# Altium project UU111_UUControl_CPUBoard.PrjPcb
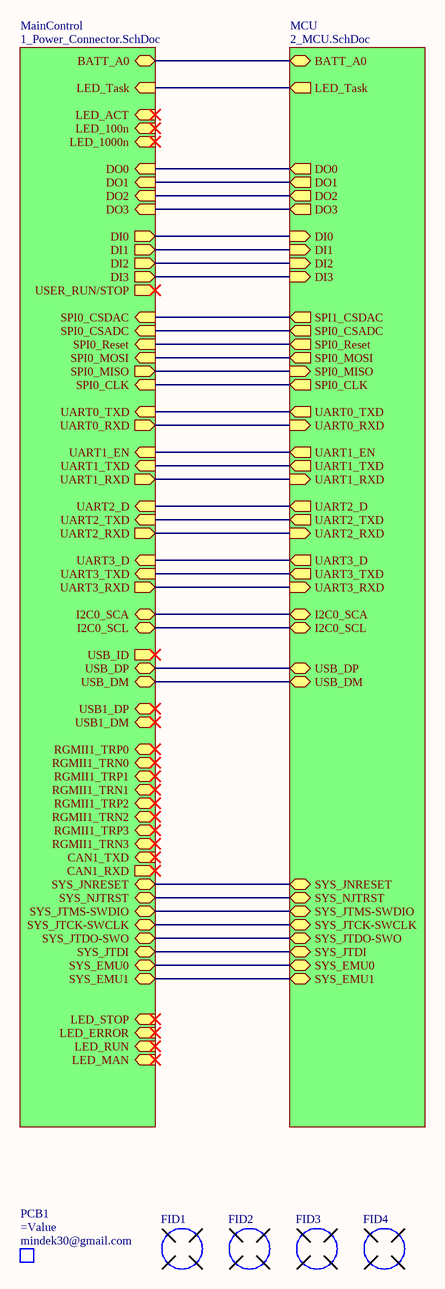
[diagram p0: 0_Overview.SchDoc]
PCB_Name: UU Control Board CPU; PCB_PN: UU111; PCB_Rev: A; PCBA_PN: UU111; PCBA_Rev: A
3 sheets, 66 parts. Net scope: hierarchical (ports join the sheet entries above them; power ports are global).
Board file: UU111_UUControl_CPUBoard.PcbDoc
Sheets:
  0_Overview.SchDoc
    MainControl = 1_Power_Connector.SchDoc
    MCU = 2_MCU.SchDoc

## Sheet 0_Overview.SchDoc: Overview
size A3; DocumentNumber: 1; SheetNumber: 1; SheetTotal: 6; PageSetup: Record=PageOptions|CenterHorizontal=True|CenterVertical=True|PrintScale=1.01|XCorrection=1.00|YCorrection=1.00|PrintKind=0|BorderSize=5000000|LeftOffset=0|BottomOffset=0|Orientation=2|PaperLength=1000|PaperWidth=1000|Scale=100|PaperSource=7|PrintQuality=-4|MediaType=1|DitherType=10|PaperKind=A3|PrintScaleMode=1

### Parts
FID1  FIDUCIAL  [FID]  (value not drawn)  (no BOM)
FID2  FIDUCIAL  [FID]  (value not drawn)  (no BOM)
FID3  FIDUCIAL  [FID]  (value not drawn)  (no BOM)
FID4  FIDUCIAL  [FID]  (value not drawn)  (no BOM)
PCB1  Manufacturer: mindek30@gmail.com  (mechanical)

### Sub-sheets
MainControl = 1_Power_Connector.SchDoc: BATT_A0 (bidir), LED_Task (in), RGMII1_TRP1 (bidir), RGMII1_TRN3 (bidir), RGMII1_TRN0 (bidir), RGMII1_TRP3 (bidir), RGMII1_TRN2 (bidir), RGMII1_TRN1 (bidir), RGMII1_TRP2 (bidir), RGMII1_TRP0 (bidir), USB_DP (bidir), USB_DM (bidir), USB1_DP (bidir), USB1_DM (bidir), USB_ID (out), I2C0_SCA (bidir), I2C0_SCL (bidir), UART3_TXD (in), UART3_D (in), UART3_RXD (out), UART1_RXD (out), UART2_TXD (in), UART1_TXD (in), UART1_EN (in), UART2_RXD (out), UART2_D (in), UART0_TXD (in), UART0_RXD (out), SPI0_MISO (out), SPI0_CLK (in), SPI0_MOSI (in), SPI0_CSADC (in), SPI0_Reset (in), LED_ACT (in), LED_100n (in), LED_1000n (in), DO1 (in), DO0 (in), DO3 (in), DO2 (in), DI3 (out), DI1 (out), DI2 (out), DI0 (out), SYS_JTCK-SWCLK (bidir), SYS_JTDI (bidir), SYS_JTDO-SWO (bidir), SYS_EMU1 (bidir), SYS_EMU0 (bidir), SYS_JNRESET (bidir), SYS_NJTRST (bidir), SYS_JTMS-SWDIO (bidir), CAN1_TXD (in), CAN1_RXD (out), SPI0_CSDAC (in), USER_RUN/STOP (out), LED_STOP (in), LED_ERROR (in), LED_RUN (in), LED_MAN (in)
MCU = 2_MCU.SchDoc: BATT_A0 (bidir), LED_Task (out), DO0 (out), DO1 (out), DO2 (out), DO3 (out), DI0 (in), DI1 (in), DI2 (in), DI3 (in), SPI0_CSADC (out), SPI0_Reset (out), SPI0_MOSI (out), SPI0_MISO (in), SPI0_CLK (out), UART0_TXD (out), UART0_RXD (in), UART1_EN (out), UART1_TXD (out), UART1_RXD (in), UART2_D (out), UART2_TXD (out), UART2_RXD (in), UART3_D (out), UART3_TXD (out), UART3_RXD (in), I2C0_SCA (bidir), I2C0_SCL (bidir), SYS_JNRESET (bidir), SYS_NJTRST (bidir), SYS_JTMS-SWDIO (bidir), SYS_JTCK-SWCLK (bidir), SYS_JTDO-SWO (bidir), SYS_JTDI (bidir), SYS_EMU0 (bidir), SYS_EMU1 (bidir), USB_DP (bidir), USB_DM (bidir), SPI1_CSDAC (out)

### Nets
I2C0_SCA: sheet MainControl/I2C0_SCA, sheet MCU/I2C0_SCA
I2C0_SCL: sheet MainControl/I2C0_SCL, sheet MCU/I2C0_SCL
LED_Task: sheet MainControl/LED_Task, sheet MCU/LED_Task
MCU_RESET: sheet MainControl/SYS_JNRESET, sheet MCU/SYS_JNRESET
SPI0_CSDAC: sheet MainControl/SPI0_CSDAC, sheet MCU/SPI1_CSDAC
SPI0_MISO: sheet MainControl/SPI0_MISO, sheet MCU/SPI0_MISO
SPI0_MOSI: sheet MainControl/SPI0_MOSI, sheet MCU/SPI0_MOSI
SPI0_SCK: sheet MainControl/SPI0_CLK, sheet MCU/SPI0_CLK
SYS_EMU0: sheet MainControl/SYS_EMU0, sheet MCU/SYS_EMU0
SYS_EMU1: sheet MainControl/SYS_EMU1, sheet MCU/SYS_EMU1
SYS_JTCK-SWCLK: sheet MainControl/SYS_JTCK-SWCLK, sheet MCU/SYS_JTCK-SWCLK
SYS_JTDI: sheet MainControl/SYS_JTDI, sheet MCU/SYS_JTDI
SYS_JTDO-SWO: sheet MainControl/SYS_JTDO-SWO, sheet MCU/SYS_JTDO-SWO
SYS_JTMS-SWDIO: sheet MainControl/SYS_JTMS-SWDIO, sheet MCU/SYS_JTMS-SWDIO
SYS_NJTRST: sheet MainControl/SYS_NJTRST, sheet MCU/SYS_NJTRST
UART0_RX: sheet MainControl/UART0_RXD, sheet MCU/UART0_RXD
UART0_TX: sheet MainControl/UART0_TXD, sheet MCU/UART0_TXD
UART1_LTE_EN: sheet MainControl/UART1_EN, sheet MCU/UART1_EN
UART1_LTE_RX: sheet MainControl/UART1_RXD, sheet MCU/UART1_RXD
UART1_LTE_TX: sheet MainControl/UART1_TXD, sheet MCU/UART1_TXD
UART2_RX: sheet MainControl/UART2_RXD, sheet MCU/UART2_RXD
UART2_TX: sheet MainControl/UART2_TXD, sheet MCU/UART2_TXD
UART3_RX: sheet MainControl/UART3_RXD, sheet MCU/UART3_RXD
UART3_TX: sheet MainControl/UART3_TXD, sheet MCU/UART3_TXD
USB_DM: sheet MainControl/USB_DM, sheet MCU/USB_DM
USB_DP: sheet MainControl/USB_DP, sheet MCU/USB_DP
NetJ101_65: sheet MainControl/DI2, sheet MCU/DI2
NetJ101_66: sheet MainControl/DI0, sheet MCU/DI0
NetJ101_67: sheet MainControl/DI3, sheet MCU/DI3
NetJ101_68: sheet MainControl/DI1, sheet MCU/DI1
NetJ101_69: sheet MainControl/DO0, sheet MCU/DO0
NetJ101_73: sheet MainControl/DO1, sheet MCU/DO1
NetJ101_75: sheet MainControl/DO2, sheet MCU/DO2
NetJ101_77: sheet MainControl/DO3, sheet MCU/DO3
NetJ101_130: sheet MainControl/UART2_D, sheet MCU/UART2_D
NetJ101_132: sheet MainControl/UART3_D, sheet MCU/UART3_D
NetJ101_139: sheet MainControl/SPI0_CSADC, sheet MCU/SPI0_CSADC
NetJ101_148: sheet MainControl/SPI0_Reset, sheet MCU/SPI0_Reset
NetJ101_165: sheet MainControl/BATT_A0, sheet MCU/BATT_A0

### Notes on the sheet
- Title :
- Revision :
- ผู้จัดทำ:
- Size:
- A3
- Time:
- ผู้เขียน:
- บริษัท ยูนิเวอร์แซล ยูทีลิตี้ส์ จำกัด (มหาชน) เลขที่ 1 อาคาร อีสท์วอเตอร์ ชั้น 18 ซอยวิภาวดีรังสิต 5 แขวงจอมพล เขตจตุจักร กรุงเทพฯ 10900
  Tel : +662-272-1688
  Fax :+662-2721690-1
- -
- Sheet:
- of
- ผู้อำนวยการ
- ผู้ตรวจสอบ:
- Number:
- กรรมการผู้จัดการ:
- File:

### Library data of the parts
FID1-FID4 = FID_FIDUCIAL: Manufacturer: mindek30@gmail.com; PartNumber: UU111_A; Value2: Non SE; Value: Non SE; PartID: A; PackageReference: Non SE; Value3: Non SE
PCB1 = PCB_Bare: BARE PCB; PartNumber: UU111_A; PackageReference: Non SE; PartID: A; Value2: =JobFile_Title; Value: =PartNumber; Value3: UU111_A

## Sheet 1_Power_Connector.SchDoc
size A3; DocumentNumber: 3; SheetNumber: 3; SheetTotal: 6; PageSetup: Record=PageOptions|CenterHorizontal=True|CenterVertical=True|PrintScale=1.01|XCorrection=1.00|YCorrection=1.00|PrintKind=0|BorderSize=5000000|LeftOffset=0|BottomOffset=0|Orientation=2|PaperLength=1000|PaperWidth=1000|Scale=100|PaperSource=7|PrintQuality=-4|MediaType=1|DitherType=10|PaperKind=A3|PrintScaleMode=1
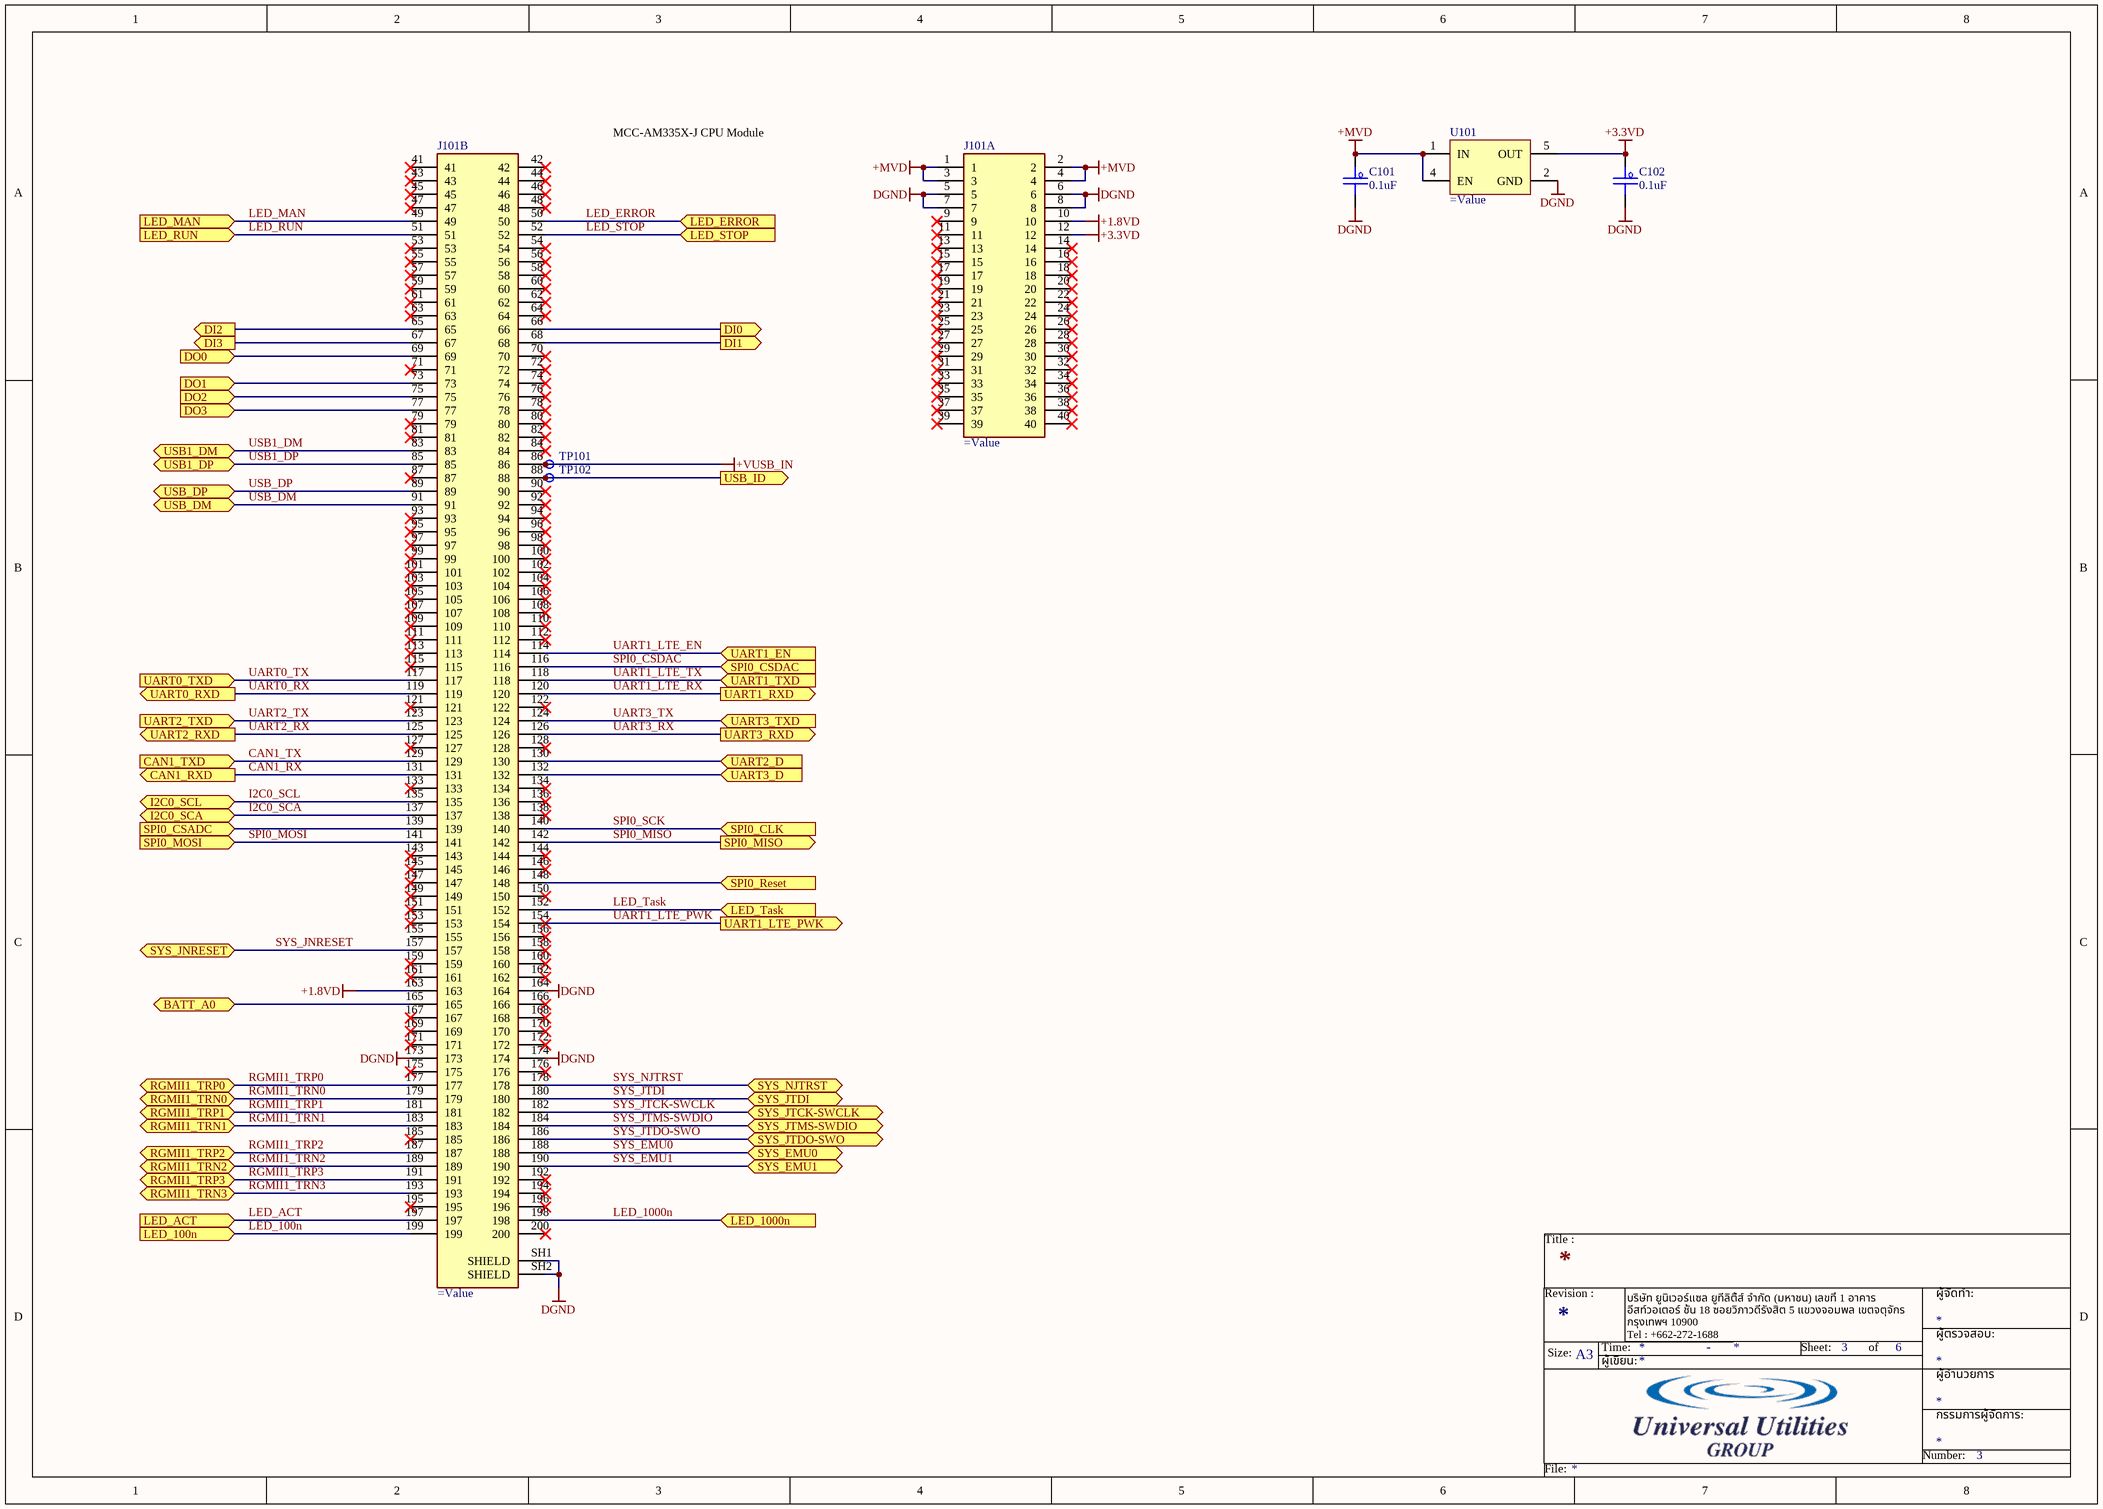
[diagram p1: 1_Power_Connector.SchDoc]

### Parts
C101  0.1uF  [C_0603]
C102  0.1uF  [C_0603]
J101  (no value)  [DDR2-SO-DIMM]  (parts A,B of 2)  (no BOM)
TP101  (no value)  [TP_Testpoint]  (no BOM)
TP102  (no value)  [TP_Testpoint]  (no BOM)
U101  (no value)  [SOT95P280X145-5N]

### Ports
BATT_A0 (bidir), CAN1_RXD (out), CAN1_TXD (in), DI0 (out), DI1 (out), DI2 (out), DI3 (out), DO0 (in), DO1 (in), DO2 (in), DO3 (in), I2C0_SCA (bidir), I2C0_SCL (bidir), LED_100n (in), LED_1000n (in), LED_ACT (in), LED_ERROR (in), LED_MAN (in), LED_RUN (in), LED_STOP (in), LED_Task (in), RGMII1_TRN0 (bidir), RGMII1_TRN1 (bidir), RGMII1_TRN2 (bidir), RGMII1_TRN3 (bidir), RGMII1_TRP0 (bidir), RGMII1_TRP1 (bidir), RGMII1_TRP2 (bidir), RGMII1_TRP3 (bidir), SPI0_CLK (in), SPI0_CSADC (in), SPI0_CSDAC (in), SPI0_MISO (out), SPI0_MOSI (in), SPI0_Reset (in), SYS_EMU0 (bidir), SYS_EMU1 (bidir), SYS_JNRESET (bidir), SYS_JTCK-SWCLK (bidir), SYS_JTDI (bidir), SYS_JTDO-SWO (bidir), SYS_JTMS-SWDIO (bidir), SYS_NJTRST (bidir), UART0_RXD (out), UART0_TXD (in), UART1_EN (in), UART1_LTE_PWK (out), UART1_RXD (out), UART1_TXD (in), UART2_D (in), UART2_RXD (out), UART2_TXD (in), UART3_D (in), UART3_RXD (out), UART3_TXD (in), USB1_DM (bidir), USB1_DP (bidir), USB_DM (bidir), USB_DP (bidir), USB_ID (out)

### Nets
+1.8VD: J101.10 J101.163
+3.3VD: C102.1 J101.12 U101.5(OUT)
+MVD: C101.1 J101.1 J101.2 J101.3 J101.4 U101.1(IN) U101.4(EN)
+VUSB_IN: J101.86 TP101.1
DGND: C101.2 C102.2 J101.5 J101.6 J101.7 J101.8 J101.164 J101.173 J101.174 J101.SH1(SHIELD) J101.SH2(SHIELD) U101.2(GND)
CAN1_RX: J101.131 ; port CAN1_RXD
CAN1_TX: J101.129 ; port CAN1_TXD
I2C0_SCA: J101.137 ; port I2C0_SCA
I2C0_SCL: J101.135 ; port I2C0_SCL
LED_100n: J101.199 ; port LED_100n
LED_1000n: J101.198 ; port LED_1000n
LED_ACT: J101.197 ; port LED_ACT
LED_ERROR: J101.50 ; port LED_ERROR
LED_MAN: J101.49 ; port LED_MAN
LED_RUN: J101.51 ; port LED_RUN
LED_STOP: J101.52 ; port LED_STOP
LED_Task: J101.152 ; port LED_Task
RGMII1_TRN0: J101.179 ; port RGMII1_TRN0
RGMII1_TRN1: J101.183 ; port RGMII1_TRN1
RGMII1_TRN2: J101.189 ; port RGMII1_TRN2
RGMII1_TRN3: J101.193 ; port RGMII1_TRN3
RGMII1_TRP0: J101.177 ; port RGMII1_TRP0
RGMII1_TRP1: J101.181 ; port RGMII1_TRP1
RGMII1_TRP2: J101.187 ; port RGMII1_TRP2
RGMII1_TRP3: J101.191 ; port RGMII1_TRP3
SPI0_CSDAC: J101.116 ; port SPI0_CSDAC
SPI0_MISO: J101.142 ; port SPI0_MISO
SPI0_MOSI: J101.141 ; port SPI0_MOSI
SPI0_SCK: J101.140 ; port SPI0_CLK
SYS_EMU0: J101.188 ; port SYS_EMU0
SYS_EMU1: J101.190 ; port SYS_EMU1
SYS_JNRESET: J101.157 ; port SYS_JNRESET  [project net MCU_RESET]
SYS_JTCK-SWCLK: J101.182 ; port SYS_JTCK-SWCLK
SYS_JTDI: J101.180 ; port SYS_JTDI
SYS_JTDO-SWO: J101.186 ; port SYS_JTDO-SWO
SYS_JTMS-SWDIO: J101.184 ; port SYS_JTMS-SWDIO
SYS_NJTRST: J101.178 ; port SYS_NJTRST
UART0_RX: J101.119 ; port UART0_RXD
UART0_TX: J101.117 ; port UART0_TXD
UART1_LTE_EN: J101.114 ; port UART1_EN
UART1_LTE_PWK: J101.154 ; port UART1_LTE_PWK
UART1_LTE_RX: J101.120 ; port UART1_RXD
UART1_LTE_TX: J101.118 ; port UART1_TXD
UART2_RX: J101.125 ; port UART2_RXD
UART2_TX: J101.123 ; port UART2_TXD
UART3_RX: J101.126 ; port UART3_RXD
UART3_TX: J101.124 ; port UART3_TXD
USB1_DM: J101.83 ; port USB1_DM
USB1_DP: J101.85 ; port USB1_DP
USB_DM: J101.91 ; port USB_DM
USB_DP: J101.89 ; port USB_DP
NetJ101_65: J101.65 ; port DI2
NetJ101_66: J101.66 ; port DI0
NetJ101_67: J101.67 ; port DI3
NetJ101_68: J101.68 ; port DI1
NetJ101_69: J101.69 ; port DO0
NetJ101_73: J101.73 ; port DO1
NetJ101_75: J101.75 ; port DO2
NetJ101_77: J101.77 ; port DO3
NetJ101_88: J101.88 TP102.1 ; port USB_ID
NetJ101_130: J101.130 ; port UART2_D
NetJ101_132: J101.132 ; port UART3_D
NetJ101_139: J101.139 ; port SPI0_CSADC
NetJ101_148: J101.148 ; port SPI0_Reset
NetJ101_165: J101.165 ; port BATT_A0

Not connected (* = marked no-connect by the designer): J101 9* 11* 13* 14* 15* 16* 17* 18* 19* 20* 21* 22* 23* 24* 25* 26* 27* 28* 29* 30* 31* 32* 33* 34* 35* 36* 37* 38* 39* 40* 41* 42* 43* 44* 45* 46* 47* 48* 53* 54* 55* 56* 57* 58* 59* 60* 61* 62* 63* 64* 70* 71* 72* 74* 76* 78* 79* 80* 81* 82* 84* 87* 90* 92* 93* 94* 95* 96* 97* 98* 99* 100* 101* 102* 103* 104* 105* 106* 107* 108* 109* 110* 111* 112* 113* 115* 121* 122* 127* 128* 133* 134* 136* 138* 143* 144* 145* 146* 147* 149* 150* 151* 153* 155 156* 158* 159* 160* 161* 162* 166* 167* 168* 169* 170* 171* 172* 175* 176* 185* 192* 194* 195* 196* 200*

### Notes on the sheet
- MCC-AM335X-J CPU Module
- Title :
- Revision :
- ผู้จัดทำ:
- Size:
- A3
- Time:
- ผู้เขียน:
- บริษัท ยูนิเวอร์แซล ยูทีลิตี้ส์ จำกัด (มหาชน) เลขที่ 1 อาคาร อีสท์วอเตอร์ ชั้น 18 ซอยวิภาวดีรังสิต 5 แขวงจอมพล เขตจตุจักร กรุงเทพฯ 10900
  Tel : +662-272-1688
  Fax :+662-2721690-1
- -
- Sheet:
- of
- ผู้อำนวยการ
- ผู้ตรวจสอบ:
- Number:
- กรรมการผู้จัดการ:
- File:

### Library data of the parts
C101 C102 = C_Capacitor: CAP CER 0.1UF 50V X7R 0603; Manufacturer: KEMET; PartNumber: C0603C104K5RACTU; PackageReference: 0603; PartID: 399-5089-1-ND; Value2: 50V; Value: 0.1uF; Value3: *
J101 = CON_DDR2: CONN SKT SODIMM 200POS R/A SMD; PartNumber: 1473149-4; Manufacturer: TE Connectivity AMP Connectors; Value: 1473149-4; PartID: A114854-ND; PackageReference: *; Value2: *; Value3: *
TP101 TP102 = TP_TestPoint: TestPoint; Manufacturer: *; PackageReference: *; PartID: *; PartNumber: *; Value2: *; Value3: *
U101 = IC_LDO_RT9069-33GB: 200mA 360mV@(10mA) Fixed 3.3V~3.3V Positive 1 36V SOT-23-5 Linear Voltage Regulators (LDO) ROHS; Manufacturer: Richtek Tech; PartNumber: RT9069-33GB; PartID: C147969; PackageReference: SOT-23-5; Value: RT9069-33GB; Value2: *; Value3: *

## Sheet 2_MCU.SchDoc
size A3; DocumentNumber: 2; SheetNumber: 2; SheetTotal: 6
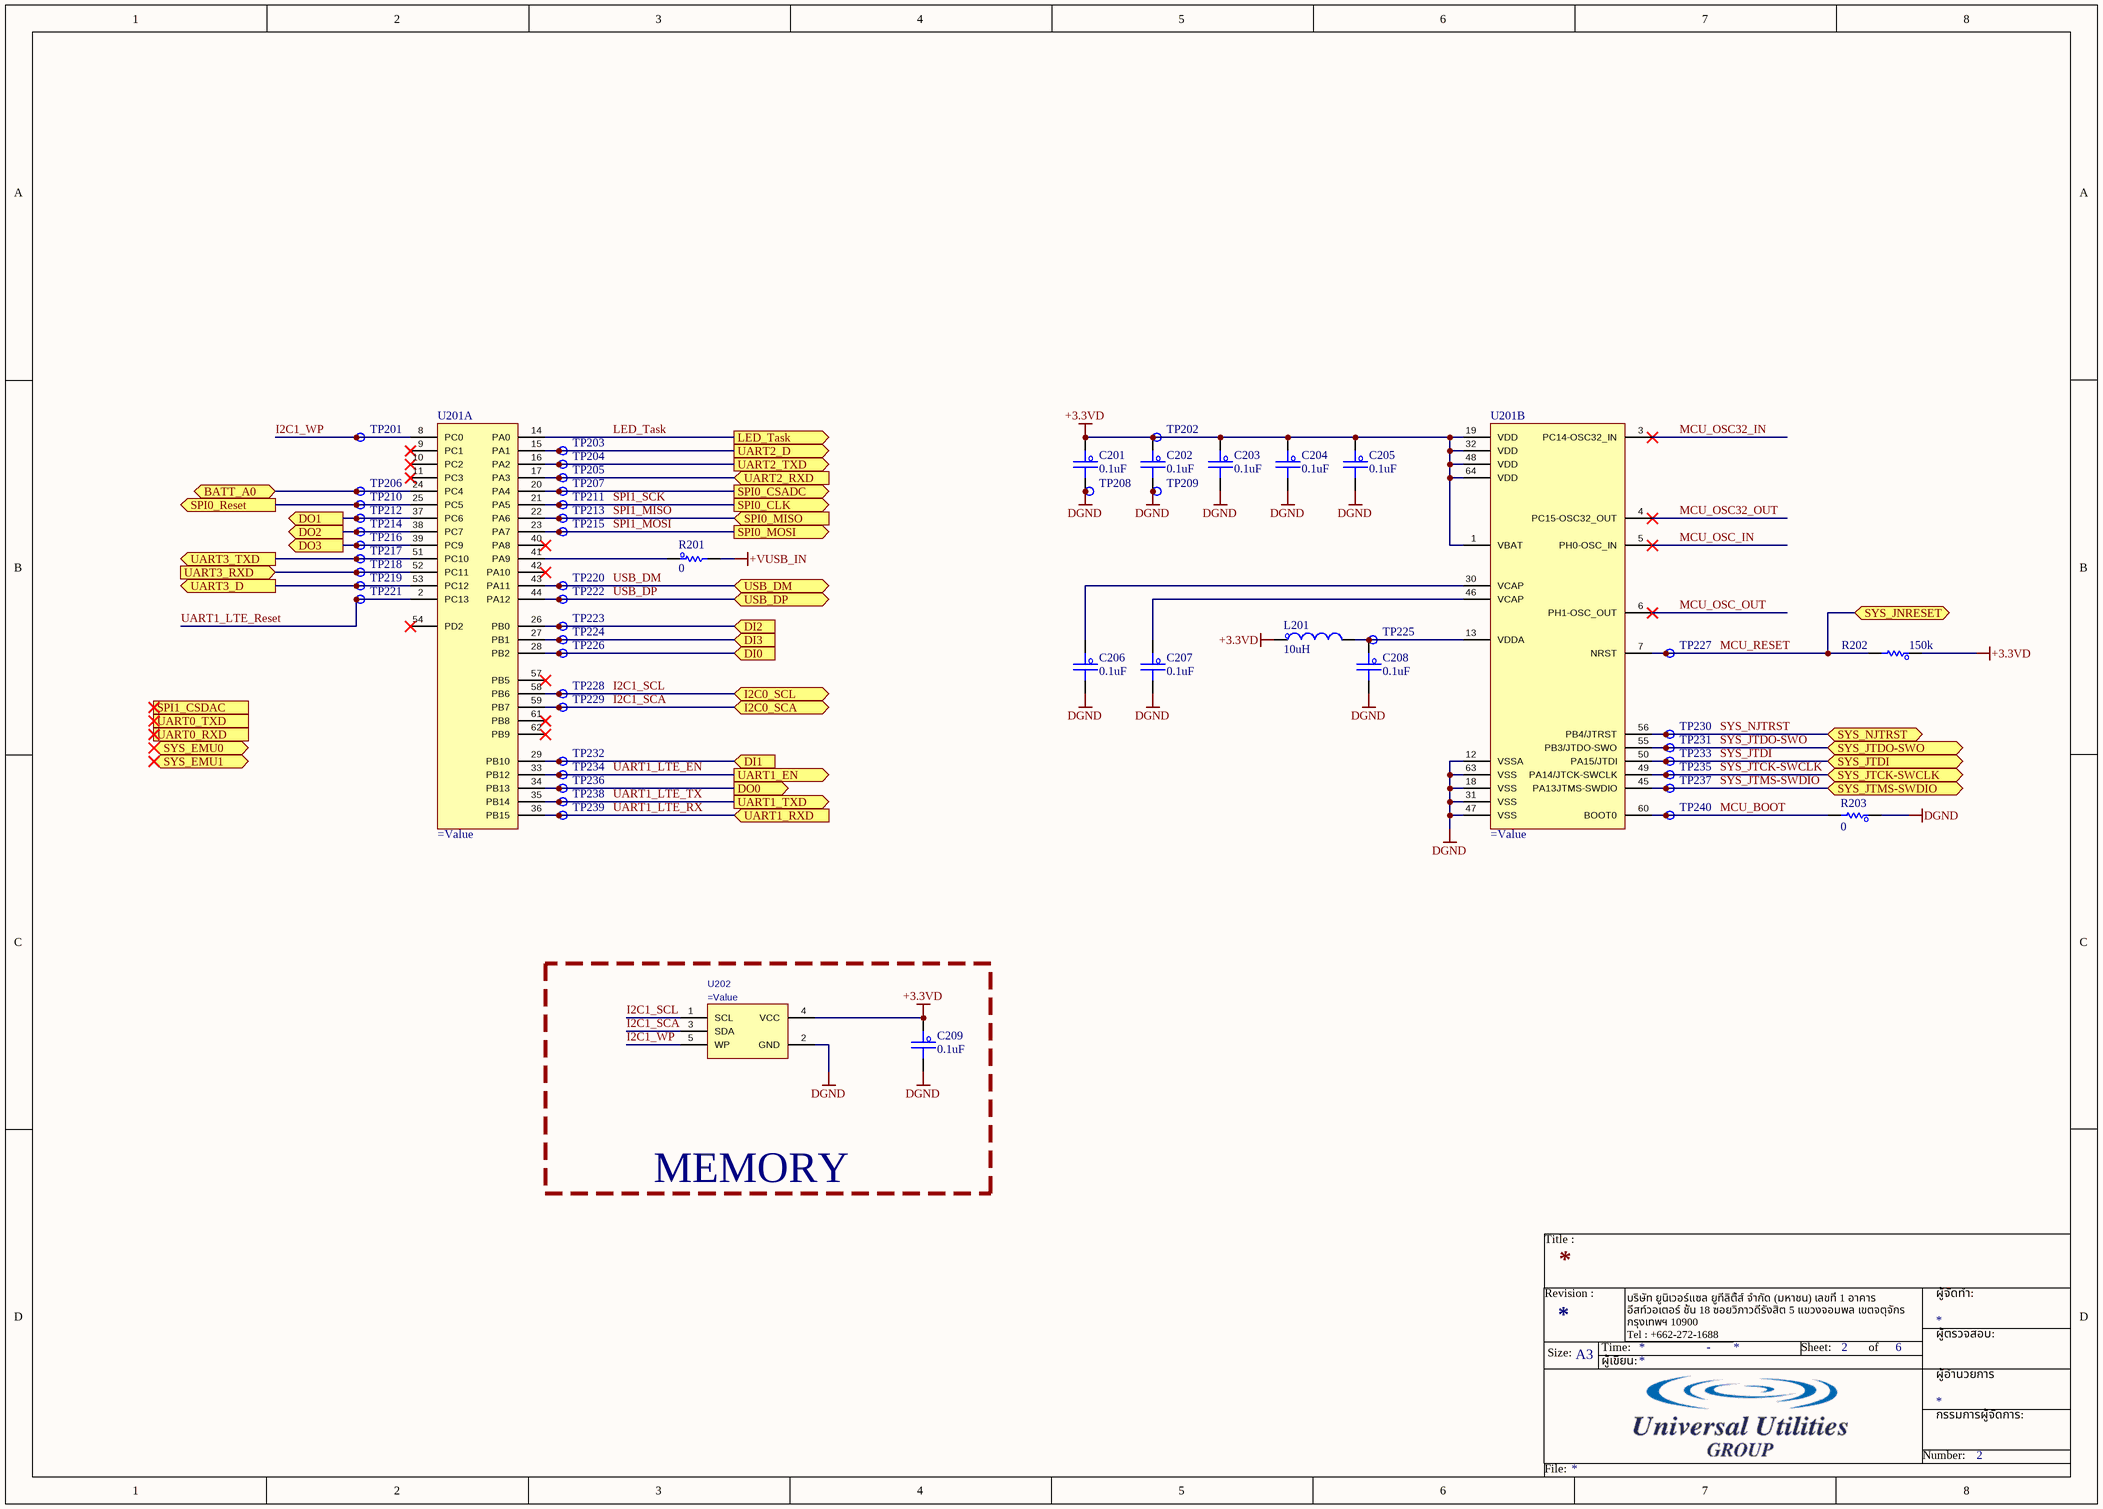
[diagram p2: 2_MCU.SchDoc]

### Parts
C201  0.1uF  [C_0603]
C202  0.1uF  [C_0603]
C203  0.1uF  [C_0603]
C204  0.1uF  [C_0603]
C205  0.1uF  [C_0603]
C206  0.1uF  [C_0603]
C207  0.1uF  [C_0603]
C208  0.1uF  [C_0603]
C209  0.1uF  [C_0603]
L201  10uH  [L_0603]
R201  0  [R_0603]
R202  150k  [R_0603]
R203  0  [R_0603]
TP201  (no value)  [TP_Testpoint]  (no BOM)
TP202  (no value)  [TP_Testpoint]  (no BOM)
TP203  (no value)  [TP_Testpoint]  (no BOM)
TP204  (no value)  [TP_Testpoint]  (no BOM)
TP205  (no value)  [TP_Testpoint]  (no BOM)
TP206  (no value)  [TP_Testpoint]  (no BOM)
TP207  (no value)  [TP_Testpoint]  (no BOM)
TP208  (no value)  [TP_Testpoint]  (no BOM)
TP209  (no value)  [TP_Testpoint]  (no BOM)
TP210  (no value)  [TP_Testpoint]  (no BOM)
TP211  (no value)  [TP_Testpoint]  (no BOM)
TP212  (no value)  [TP_Testpoint]  (no BOM)
TP213  (no value)  [TP_Testpoint]  (no BOM)
TP214  (no value)  [TP_Testpoint]  (no BOM)
TP215  (no value)  [TP_Testpoint]  (no BOM)
TP216  (no value)  [TP_Testpoint]  (no BOM)
TP217  (no value)  [TP_Testpoint]  (no BOM)
TP218  (no value)  [TP_Testpoint]  (no BOM)
TP219  (no value)  [TP_Testpoint]  (no BOM)
TP220  (no value)  [TP_Testpoint]  (no BOM)
TP221  (no value)  [TP_Testpoint]  (no BOM)
TP222  (no value)  [TP_Testpoint]  (no BOM)
TP223  (no value)  [TP_Testpoint]  (no BOM)
TP224  (no value)  [TP_Testpoint]  (no BOM)
TP225  (no value)  [TP_Testpoint]  (no BOM)
TP226  (no value)  [TP_Testpoint]  (no BOM)
TP227  (no value)  [TP_Testpoint]  (no BOM)
TP228  (no value)  [TP_Testpoint]  (no BOM)
TP229  (no value)  [TP_Testpoint]  (no BOM)
TP230  (no value)  [TP_Testpoint]  (no BOM)
TP231  (no value)  [TP_Testpoint]  (no BOM)
TP232  (no value)  [TP_Testpoint]  (no BOM)
TP233  (no value)  [TP_Testpoint]  (no BOM)
TP234  (no value)  [TP_Testpoint]  (no BOM)
TP235  (no value)  [TP_Testpoint]  (no BOM)
TP236  (no value)  [TP_Testpoint]  (no BOM)
TP237  (no value)  [TP_Testpoint]  (no BOM)
TP238  (no value)  [TP_Testpoint]  (no BOM)
TP239  (no value)  [TP_Testpoint]  (no BOM)
TP240  (no value)  [TP_Testpoint]  (no BOM)
U201  (no value)  [LQFP64]  (parts A,B of 2)
U202  (no value)  [SOT65P210X110-5N]

### Blocks framed on the sheet
MEMORY: C209 U202

### Ports
BATT_A0 (bidir), DI0 (in), DI1 (in), DI2 (in), DI3 (in), DO0 (out), DO1 (out), DO2 (out), DO3 (out), I2C0_SCA (bidir), I2C0_SCL (bidir), LED_Task (out), SPI0_CLK (out), SPI0_CSADC (out), SPI0_MISO (in), SPI0_MOSI (out), SPI0_Reset (out), SPI1_CSDAC (out), SYS_EMU0 (bidir), SYS_EMU1 (bidir), SYS_JNRESET (bidir), SYS_JTCK-SWCLK (bidir), SYS_JTDI (bidir), SYS_JTDO-SWO (bidir), SYS_JTMS-SWDIO (bidir), SYS_NJTRST (bidir), UART0_RXD (in), UART0_TXD (out), UART1_EN (out), UART1_RXD (in), UART1_TXD (out), UART2_D (out), UART2_RXD (in), UART2_TXD (out), UART3_D (out), UART3_RXD (in), UART3_TXD (out), USB_DM (bidir), USB_DP (bidir)

### Nets
+3.3VD: C201.1 C202.1 C203.1 C204.1 C205.1 C209.1 L201.1 R202.1 TP202.1 U201.1(VBAT) U201.19(VDD) U201.32(VDD) U201.48(VDD) U201.64(VDD) U202.4(VCC)
+VUSB_IN: R201.2
DGND: C201.2 C202.2 C203.2 C204.2 C205.2 C206.2 C207.2 C208.2 C209.2 R203.1 TP208.1 TP209.1 U201.12(VSSA) U201.18(VSS) U201.31(VSS) U201.47(VSS) U201.63(VSS) U202.2(GND)
I2C1_SCA: TP229.1 U201.59(PB7) U202.3(SDA) ; port I2C0_SCA  [project net I2C0_SCA]
I2C1_SCL: TP228.1 U201.58(PB6) U202.1(SCL) ; port I2C0_SCL  [project net I2C0_SCL]
I2C1_WP: TP201.1 U201.8(PC0) U202.5(WP)
LED_Task: U201.14(PA0) ; port LED_Task
MCU_BOOT: R203.2 TP240.1 U201.60(BOOT0)
MCU_OSC32_IN: U201.3(PC14-OSC32_IN)
MCU_OSC32_OUT: U201.4(PC15-OSC32_OUT)
MCU_OSC_IN: U201.5(PH0-OSC_IN)
MCU_OSC_OUT: U201.6(PH1-OSC_OUT)
MCU_RESET: R202.2 TP227.1 U201.7(NRST) ; port SYS_JNRESET
SPI1_MISO: TP213.1 U201.22(PA6) ; port SPI0_MISO  [project net SPI0_MISO]
SPI1_MOSI: TP215.1 U201.23(PA7) ; port SPI0_MOSI  [project net SPI0_MOSI]
SPI1_SCK: TP211.1 U201.21(PA5) ; port SPI0_CLK  [project net SPI0_SCK]
SYS_JTCK-SWCLK: TP235.1 U201.49(PA14/JTCK-SWCLK) ; port SYS_JTCK-SWCLK
SYS_JTDI: TP233.1 U201.50(PA15/JTDI) ; port SYS_JTDI
SYS_JTDO-SWO: TP231.1 U201.55(PB3/JTDO-SWO) ; port SYS_JTDO-SWO
SYS_JTMS-SWDIO: TP237.1 U201.45(PA13JTMS-SWDIO) ; port SYS_JTMS-SWDIO
SYS_NJTRST: TP230.1 U201.56(PB4/JTRST) ; port SYS_NJTRST
UART1_LTE_EN: TP234.1 U201.33(PB12) ; port UART1_EN
UART1_LTE_Reset: TP221.1 U201.2(PC13)
UART1_LTE_RX: TP239.1 U201.36(PB15) ; port UART1_RXD
UART1_LTE_TX: TP238.1 U201.35(PB14) ; port UART1_TXD
UART2_RX: TP205.1 U201.17(PA3) ; port UART2_RXD
UART2_TX: TP204.1 U201.16(PA2) ; port UART2_TXD
UART3_RX: TP218.1 U201.52(PC11) ; port UART3_RXD
UART3_TX: TP217.1 U201.51(PC10) ; port UART3_TXD
USB_DM: TP220.1 U201.43(PA11) ; port USB_DM
USB_DP: TP222.1 U201.44(PA12) ; port USB_DP
NetC206_1: C206.1 U201.30(VCAP)
NetC207_1: C207.1 U201.46(VCAP)
NetC208_1: C208.1 L201.2 TP225.1 U201.13(VDDA)
NetJ101_65: TP223.1 U201.26(PB0) ; port DI2
NetJ101_66: TP226.1 U201.28(PB2) ; port DI0
NetJ101_67: TP224.1 U201.27(PB1) ; port DI3
NetJ101_68: TP232.1 U201.29(PB10) ; port DI1
NetJ101_69: TP236.1 U201.34(PB13) ; port DO0
NetJ101_73: TP212.1 U201.37(PC6) ; port DO1
NetJ101_75: TP214.1 U201.38(PC7) ; port DO2
NetJ101_77: TP216.1 U201.39(PC9) ; port DO3
NetJ101_130: TP203.1 U201.15(PA1) ; port UART2_D
NetJ101_132: TP219.1 U201.53(PC12) ; port UART3_D
NetJ101_139: TP207.1 U201.20(PA4) ; port SPI0_CSADC
NetJ101_148: TP210.1 U201.25(PC5) ; port SPI0_Reset
NetJ101_165: TP206.1 U201.24(PC4) ; port BATT_A0
NetR201_1: R201.1 U201.41(PA9)

Not connected (* = marked no-connect by the designer): U201 9(PC1)* 10(PC2)* 11(PC3)* 40(PA8)* 42(PA10)* 54(PD2)* 57(PB5)* 61(PB8)* 62(PB9)*

### Notes on the sheet
- Title :
- Revision :
- ผู้จัดทำ:
- Size:
- A3
- Time:
- ผู้เขียน:
- บริษัท ยูนิเวอร์แซล ยูทีลิตี้ส์ จำกัด (มหาชน) เลขที่ 1 อาคาร อีสท์วอเตอร์ ชั้น 18 ซอยวิภาวดีรังสิต 5 แขวงจอมพล เขตจตุจักร กรุงเทพฯ 10900
  Tel : +662-272-1688
  Fax :+662-2721690-1
- -
- Sheet:
- of
- ผู้อำนวยการ
- ผู้ตรวจสอบ:
- Number:
- กรรมการผู้จัดการ:
- File:

### Library data of the parts
C201-C209 = C_Capacitor: as C101 on sheet 1_Power_Connector; PackageReference: 0603; PartID: 399-5089-1-ND; Value2: 50V; Value: 0.1uF; Value3: *
L201 = L_Inductor: 10µH Shielded Multilayer Inductor 250mA 1.05Ohm 0603 (1608 Metric); Manufacturer: TDK Corporation; PartNumber: MLZ1608M100WT000; Value: 10uH; PackageReference: 0603; PartID: 445-6389-1-ND; Value3: *
R201 R203 = R_Resister: RES SMD 0 OHM JUMP 1/10W 0603; Manufacturer: Vishay Dale; PartNumber: CRCW06030000Z0EBC; Value2: 0.1W; Value: 0; PackageReference: 0603; PartID: 541-4013-1-ND; Value3: *
R202 = R_Resister: RES SMD 150K OHM 1% 1/10W 0603; Manufacturer: Vishay Dale; PartNumber: CRCW0603150KFKEAC; Value2: 0.1W; Value: 150k; PackageReference: 0603; PartID: 541-4034-1-ND; Value3: *
TP201-TP240 = TP_TestPoint: TestPoint; Manufacturer: *; PackageReference: *; PartID: *; PartNumber: *; Value2: *; Value3: *
U201 = IC_MCU_STM32H7A3RGT6: IC MCU 32BIT 1376KB FLSH 64LQFP; Manufacturer: STMicroelectronics; PartNumber: STM32H7A3RGT6; PartID: 511-STM32H7A3RGT6; PackageReference: LQFP-64; Value: STM32H7A3RGT6; Value2: *; Value3: *
U202 = IC_MEM_24AA02HT: IC EEPROM 2KBIT I2C SC70-5; Manufacturer: Microchip Technology; Value: 24AA02HT-I/LT; PackageReference: SC-70-5; PartID: 24AA02HT-I/LTCT-ND; PartNumber: 24AA02HT-I/LT

## Nets that join several sheets
+3.3VD: 1_Power_Connector (C102.1 J101.12 U101.5), 2_MCU (15 pins)
+VUSB_IN: 1_Power_Connector (J101.86 TP101.1), 2_MCU (R201.2)
DGND: 1_Power_Connector (12 pins), 2_MCU (18 pins)
I2C0_SCA: 1_Power_Connector (J101.137), 2_MCU (TP229.1 U201.59 U202.3)
I2C0_SCL: 1_Power_Connector (J101.135), 2_MCU (TP228.1 U201.58 U202.1)
LED_Task: 1_Power_Connector (J101.152), 2_MCU (U201.14)
MCU_RESET: 1_Power_Connector (J101.157), 2_MCU (R202.2 TP227.1 U201.7)
NetJ101_65: 1_Power_Connector (J101.65), 2_MCU (TP223.1 U201.26)
NetJ101_66: 1_Power_Connector (J101.66), 2_MCU (TP226.1 U201.28)
NetJ101_67: 1_Power_Connector (J101.67), 2_MCU (TP224.1 U201.27)
NetJ101_68: 1_Power_Connector (J101.68), 2_MCU (TP232.1 U201.29)
NetJ101_69: 1_Power_Connector (J101.69), 2_MCU (TP236.1 U201.34)
NetJ101_73: 1_Power_Connector (J101.73), 2_MCU (TP212.1 U201.37)
NetJ101_75: 1_Power_Connector (J101.75), 2_MCU (TP214.1 U201.38)
NetJ101_77: 1_Power_Connector (J101.77), 2_MCU (TP216.1 U201.39)
NetJ101_130: 1_Power_Connector (J101.130), 2_MCU (TP203.1 U201.15)
NetJ101_132: 1_Power_Connector (J101.132), 2_MCU (TP219.1 U201.53)
NetJ101_139: 1_Power_Connector (J101.139), 2_MCU (TP207.1 U201.20)
NetJ101_148: 1_Power_Connector (J101.148), 2_MCU (TP210.1 U201.25)
NetJ101_165: 1_Power_Connector (J101.165), 2_MCU (TP206.1 U201.24)
SPI0_MISO: 1_Power_Connector (J101.142), 2_MCU (TP213.1 U201.22)
SPI0_MOSI: 1_Power_Connector (J101.141), 2_MCU (TP215.1 U201.23)
SPI0_SCK: 1_Power_Connector (J101.140), 2_MCU (TP211.1 U201.21)
SYS_JTCK-SWCLK: 1_Power_Connector (J101.182), 2_MCU (TP235.1 U201.49)
SYS_JTDI: 1_Power_Connector (J101.180), 2_MCU (TP233.1 U201.50)
SYS_JTDO-SWO: 1_Power_Connector (J101.186), 2_MCU (TP231.1 U201.55)
SYS_JTMS-SWDIO: 1_Power_Connector (J101.184), 2_MCU (TP237.1 U201.45)
SYS_NJTRST: 1_Power_Connector (J101.178), 2_MCU (TP230.1 U201.56)
UART1_LTE_EN: 1_Power_Connector (J101.114), 2_MCU (TP234.1 U201.33)
UART1_LTE_RX: 1_Power_Connector (J101.120), 2_MCU (TP239.1 U201.36)
UART1_LTE_TX: 1_Power_Connector (J101.118), 2_MCU (TP238.1 U201.35)
UART2_RX: 1_Power_Connector (J101.125), 2_MCU (TP205.1 U201.17)
UART2_TX: 1_Power_Connector (J101.123), 2_MCU (TP204.1 U201.16)
UART3_RX: 1_Power_Connector (J101.126), 2_MCU (TP218.1 U201.52)
UART3_TX: 1_Power_Connector (J101.124), 2_MCU (TP217.1 U201.51)
USB_DM: 1_Power_Connector (J101.91), 2_MCU (TP220.1 U201.43)
USB_DP: 1_Power_Connector (J101.89), 2_MCU (TP222.1 U201.44)